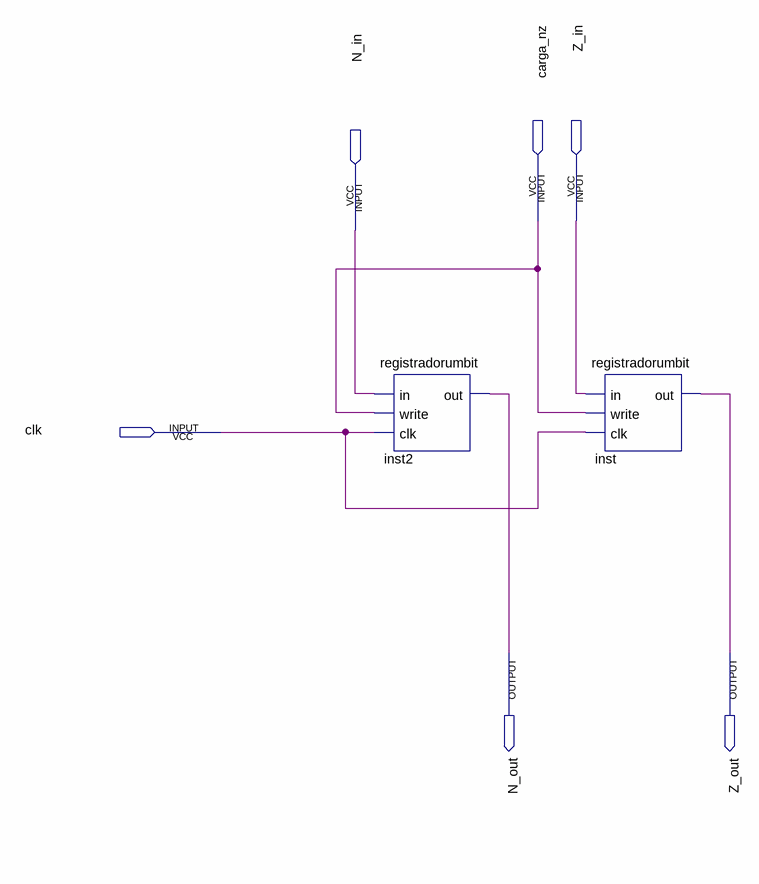
[diagram p0: schematic sheet]
// Quartus schematic registradordoisbits.bdf as structural Verilog: 2 symbols, 6 pins
module registradordoisbits (
  input  carga_nz,
  input  Z_in,
  input  N_in,
  input  clk,
  output N_out,
  output Z_out
);

  registradorumbit inst2 (.in(N_in), .write(carga_nz), .clk(clk), .out(N_out));
  registradorumbit inst (.in(Z_in), .write(carga_nz), .clk(clk), .out(Z_out));
endmodule
